# Altium schematic sheet 02_LAN7800_Controller.SchDoc
size A4; SheetNumber: 2; SheetTotal: 2
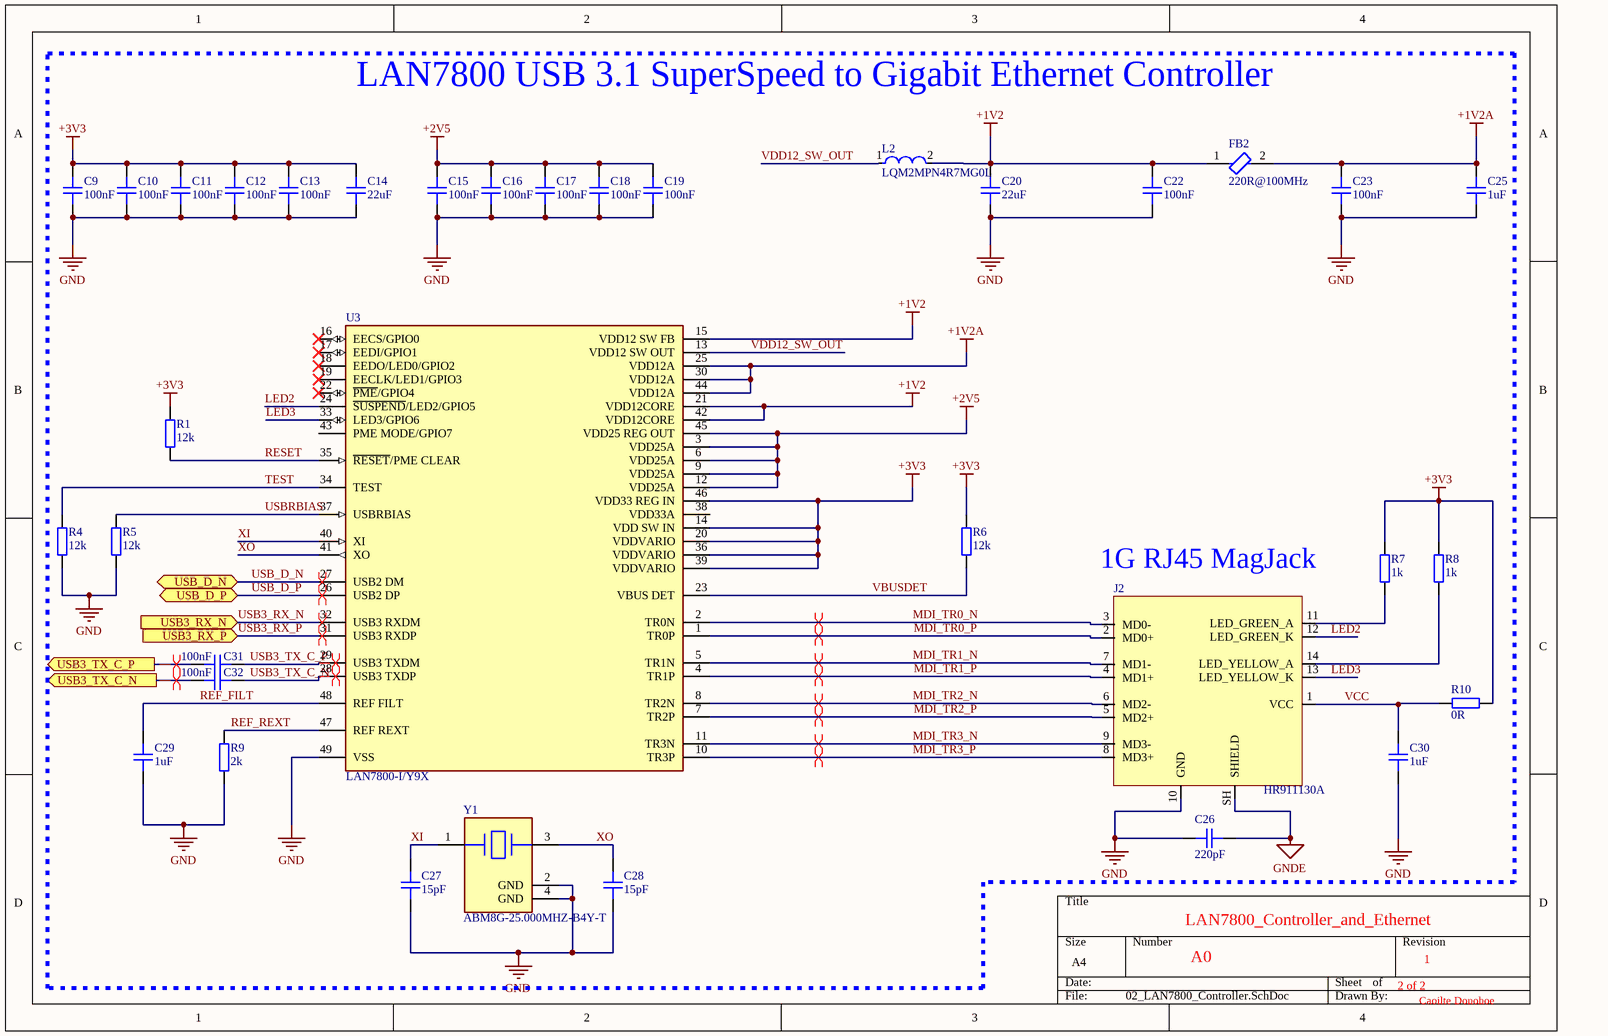
[diagram p0: 02_LAN7800_Controller.SchDoc]

## Parts
C9  100nF  [CAP_0402]
C10  100nF  [CAP_0402]
C11  100nF  [CAP_0402]
C12  100nF  [CAP_0402]
C13  100nF  [CAP_0402]
C14  22uF  [CAP_0603]
C15  100nF  [CAP_0402]
C16  100nF  [CAP_0402]
C17  100nF  [CAP_0402]
C18  100nF  [CAP_0402]
C19  100nF  [CAP_0402]
C20  22uF  [CAP_0603]
C22  100nF  [CAP_0402]
C23  100nF  [CAP_0402]
C25  1uF  [CAP_0402]
C26  220pF  [CAP_0603]
C27  15pF  [CAP_0603]
C28  15pF  [CAP_0603]
C29  1uF  [CAP_0402]
C30  1uF  [CAP_0402]
C31  100nF  [CAP_0402]
C32  100nF  [CAP_0402]
FB2  220R@100MHz  [FP-BLM21-0_2-t0_85-e0_5-IPC_C]
J2  HR911130A  [HR911130A]
L2  LQM2MPN4R7MG0L  [FP-LQM2MPN_G0-IPC_B]
R1  12k  [RES_0402]
R4  12k  [RES_0402]
R5  12k  [RES_0402]
R6  12k  [RES_0402]
R7  1k  [RES_0402]
R8  1k  [RES_0402]
R9  2k  [RES_0402]
R10  0R  [RES_0402]
U3  LAN7800-I/Y9X  [FP-48SQFN-5304-7x7B-IPC_B]
Y1  ABM8G-25.000MHZ-B4Y-T  [FP-ABM8G-MFG]

## Ports
USB3_RX_N (in, see 01_USB_B_and_Power[2C]), USB3_RX_P (in, see 01_USB_B_and_Power[2C]), USB3_TX_C_N (out, see 01_USB_B_and_Power[2C]), USB3_TX_C_P (out, see 01_USB_B_and_Power[2C]), USB_D_N (bidir, see 01_USB_B_and_Power[2C]), USB_D_P (bidir, see 01_USB_B_and_Power[2C])

## Nets
+1V2: C20.2 C22.2 FB2.1 L2.2 U3.15(VDD12_SW_FB) U3.21(VDD12CORE) U3.42(VDD12CORE)
+1V2A: C23.2 C25.2 FB2.2 U3.25(VDD12A) U3.30(VDD12A) U3.44(VDD12A)
+2V5: C15.2 C16.2 C17.2 C18.2 C19.2 U3.3(VDD25A) U3.6(VDD25A) U3.9(VDD25A) U3.12(VDD25A) U3.45(VDD25_REG_OUT)
+3V3: C9.2 C10.2 C11.2 C12.2 C13.2 C14.2 R1.2 R6.1 R7.1 R8.1 R10.2 U3.14(VDD_SW_IN) U3.20(VDDVARIO) U3.36(VDDVARIO) U3.39(VDDVARIO) U3.46(VDD33_REG_IN)
GND: C9.1 C10.1 C11.1 C12.1 C13.1 C14.1 C15.1 C16.1 C17.1 C18.1 C19.1 C20.1 C22.1 C23.1 C25.1 C26.1 C27.1 C28.1 C29.1 C30.1 J2.10(GND) R4.1 R5.1 R9.1 U3.49(VSS) Y1.2(GND) Y1.4(GND)
GNDE: C26.2 J2.SH(SHIELD)
LED2: J2.12(LED_GREEN_K) U3.24(~{SUSPEND}/LED2/GPIO5)
LED3: J2.13(LED_YELLOW_K) U3.33(LED3/GPIO6)
MDI_TR0_N: J2.3(MD0-) U3.2(TR0N)
MDI_TR0_P: J2.2(MD0+) U3.1(TR0P)
MDI_TR1_N: J2.7(MD1-) U3.5(TR1N)
MDI_TR1_P: J2.4(MD1+) U3.4(TR1P)
MDI_TR2_N: J2.6(MD2-) U3.8(TR2N)
MDI_TR2_P: J2.5(MD2+) U3.7(TR2P)
MDI_TR3_N: J2.9(MD3-) U3.11(TR3N)
MDI_TR3_P: J2.8(MD3+) U3.10(TR3P)
REF_FILT: C29.2 U3.48(REF_FILT)
REF_REXT: R9.2 U3.47(REF_REXT)
RESET: R1.1 U3.35(~{RESET}/PME_CLEAR)
TEST: R4.2 U3.34(TEST)
USB3_RX_N: U3.32(USB3_RXDM) ; port USB3_RX_N
USB3_RX_P: U3.31(USB3_RXDP) ; port USB3_RX_P
USB3_TX_C_N: C32.1 U3.28(USB3_TXDP)
USB3_TX_C_N: C32.2 ; port USB3_TX_C_N  [a separate net that carries the same name]
USB3_TX_C_P: C31.1 U3.29(USB3_TXDM)
USB3_TX_C_P: C31.2 ; port USB3_TX_C_P  [a separate net that carries the same name]
USB_D_N: U3.27(USB2_DM) ; port USB_D_N
USB_D_P: U3.26(USB2_DP) ; port USB_D_P
USBRBIAS: R5.2 U3.37(USBRBIAS)
VBUSDET: R6.2 U3.23(VBUS_DET)
VCC: C30.2 J2.1(VCC) R10.1
VDD12_SW_OUT: L2.1 U3.13(VDD12_SW_OUT)
XI: C27.2 U3.40(XI) Y1.1
XO: C28.2 U3.41(XO) Y1.3
NetJ2_11: J2.11(LED_GREEN_A) R7.2
NetJ2_14: J2.14(LED_YELLOW_A) R8.2

Not connected (* = marked no-connect by the designer): U3 16(EECS/GPIO0)* 17(EEDI/GPIO1)* 18(EEDO/LED0/GPIO2)* 19(EECLK/LED1/GPIO3)* 22(~{PME}/GPIO4)* 38(VDD33A) 43(PME_MODE/GPIO7)

## Layout directives
differential pair: MDI_TR0_N, MDI_TR0_P, MDI_TR1_N, MDI_TR1_P, MDI_TR2_N, MDI_TR2_P, MDI_TR3_N, MDI_TR3_P, USB3_RX_N, USB3_RX_P, USB3_TX_C_N, USB3_TX_C_P, USB_D_N, USB_D_P

## Notes on the sheet
- LAN7800 USB 3.1 SuperSpeed to Gigabit Ethernet Controller
- 1G RJ45 MagJack
- LAN7800_Controller_and_Ethernet
- A0
- 2 of 2
- 1
- Caoilte Donohoe

## Library data of the parts
C9-C13 C15-C19 C22 C23 C25 C29-C32 = CAP_0402: Capacitor SMD 0402; Manufacturer: *; Manufacturer Part Number: *; Distributor Link: *; LCSC: *; Rating: *; Dielectric: *
C14 C20 C26-C28 = CAP_0603: Capacitor SMD 0603; Manufacturer: *; Manufacturer Part Number: *; Distributor Link: *; LCSC: *; Rating: *; Dielectric: *
FB2 = CMP-0686-00610-3: Chip Ferrite Bead, 0805, 220Ω @ 100MHz, 0.045Ω, 25%, 2A; Number of Circuits: 1; Shielding: Unshielded; DC Resistance (DCR): 45mR; Impedance: 220R; Radiation Hardening: No; Material: Ferrite; Frequency: 100MHz; Width: 1.25mm; DC Current: 2A; Max DC Current: 2A; Number of Lines: 1; Package Quantity: 1; Case Code (Metric): 2012; Current Rating: 2A; Case/Package: 0805; Current: 2A; Military Standard: Not; Core Material: Ferrite; Depth: 1.25mm; Contact Plating: Tin; DC Resistance-Max: 45mR; Max Operating Temperature: 125°C; Length: 2mm; Max Current Rating: 2A; REACH SVHC: No SVHC; Termination: SMD/SMT; Min Operating Temperature: -55°C; Series: BLM21P; Test Frequency: 100MHz; Tolerance: 25%; Number of Pins: 2; RoHS Compliant: Yes; Height: 0.85mm; Packaging: Tape and Reel; Lead Free: Lead Free; Case Code (Imperial): 0805
J2 = HR911130A: 100/1000Base-T Magnetics Single-Port RJ45 Connector with Integrated Magnetics and LEDs; Manufacturer: Hanrun; Manufacturer Part Number: HR911130A
L2 = CMP-06042-016483-1: Multilayer Type Inductor for Power Lines, 0806 (2016), 4.7μH, 20%, 0.175Ω, 1.1A; Self Resonant Frequency: 20MHz; DC Resistance (DCR): 175mR; Test Frequency: 1MHz; Core Material: Ferrite; Shielding: Shielded; Inductance: 4.7uH; Max DC Current: 1.1A; Case Code (Metric): 2016; Min Operating Temperature: -55°C; Military Standard: Not; Depth: 1.75mm; RoHS Compliant: Yes; Packaging: Tape and Reel; Termination: SMD/SMT; Max Operating Temperature: 125°C; Case Code (Imperial): 0806; Width: 0.049inch; Package Quantity: 3000; Length: 0.079inch; DC Current: 1.1A; Mount: Surface Mount; Current Rating: 1.1A; Height - Seated (Max): 0.039inch; Case/Package: 0805; Weight: 0.000353oz; Height: 0.9mm; Tolerance: 20%
R1 R4-R10 = RES_0402: Resistor SMD 0402; Manufacturer: *; Manufacturer Part Number: *; Distributor Link: *; LCSC: *
U3 = CMP-06298-000014-1: IC ETHERNET CTLR USB 48SQFN; Operating Supply Current: 4mA; Min Operating Temperature: -40°C; Max Operating Temperature: 85°C; Packaging: Tray
Y1 = CMP-27762-000021-2: Crystal 25MHz ±30ppm (Tol) ±30ppm (Stability) 10pF FUND 60Ω 4-Pin SMD T/R; ESR (Equivalent Series Resistance): 60R; Depth: 2.5mm; Frequency Stability: 30ppm; Mount: Surface Mount; Lead Free: Lead Free; Max Operating Temperature: 70°C; Series: ABM8G; Frequency Tolerance: 30ppm; Min Operating Temperature: -20°C; Number of Pins: 4; Operating Frequency: 25 MHz; Termination: SMD/SMT; Frequency: 25MHz; Case/Package: CSMD; Packaging: Tape and Reel; Package Quantity: 1000; Tolerance: 30ppm; Length: 3.2mm; Height: 0.039inch; Load Capacitance: 10pF; Width: 0.098inch; Series Resistance: 60R